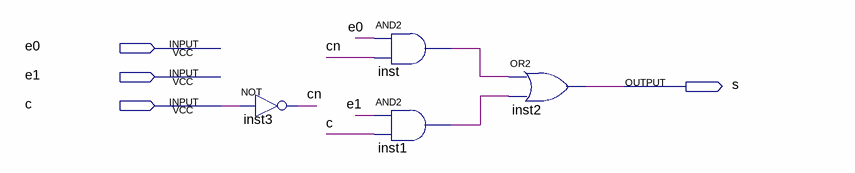
[diagram p0: schematic sheet]
// Quartus schematic ldm_mux_2x1_1bit.bdf as structural Verilog: 4 symbols, 4 pins
module ldm_mux_2x1_1bit (
  input  e0,
  input  e1,
  input  c,
  output s
);

  wire cn, inst1_out, inst_out;

  not inst3 (cn, c);
  and inst (inst_out, e0, cn);
  and inst1 (inst1_out, e1, c);
  or inst2 (s, inst_out, inst1_out);
endmodule
